# Altium project _PCB_Cubesat_4L_Project_Template.PrjPcb
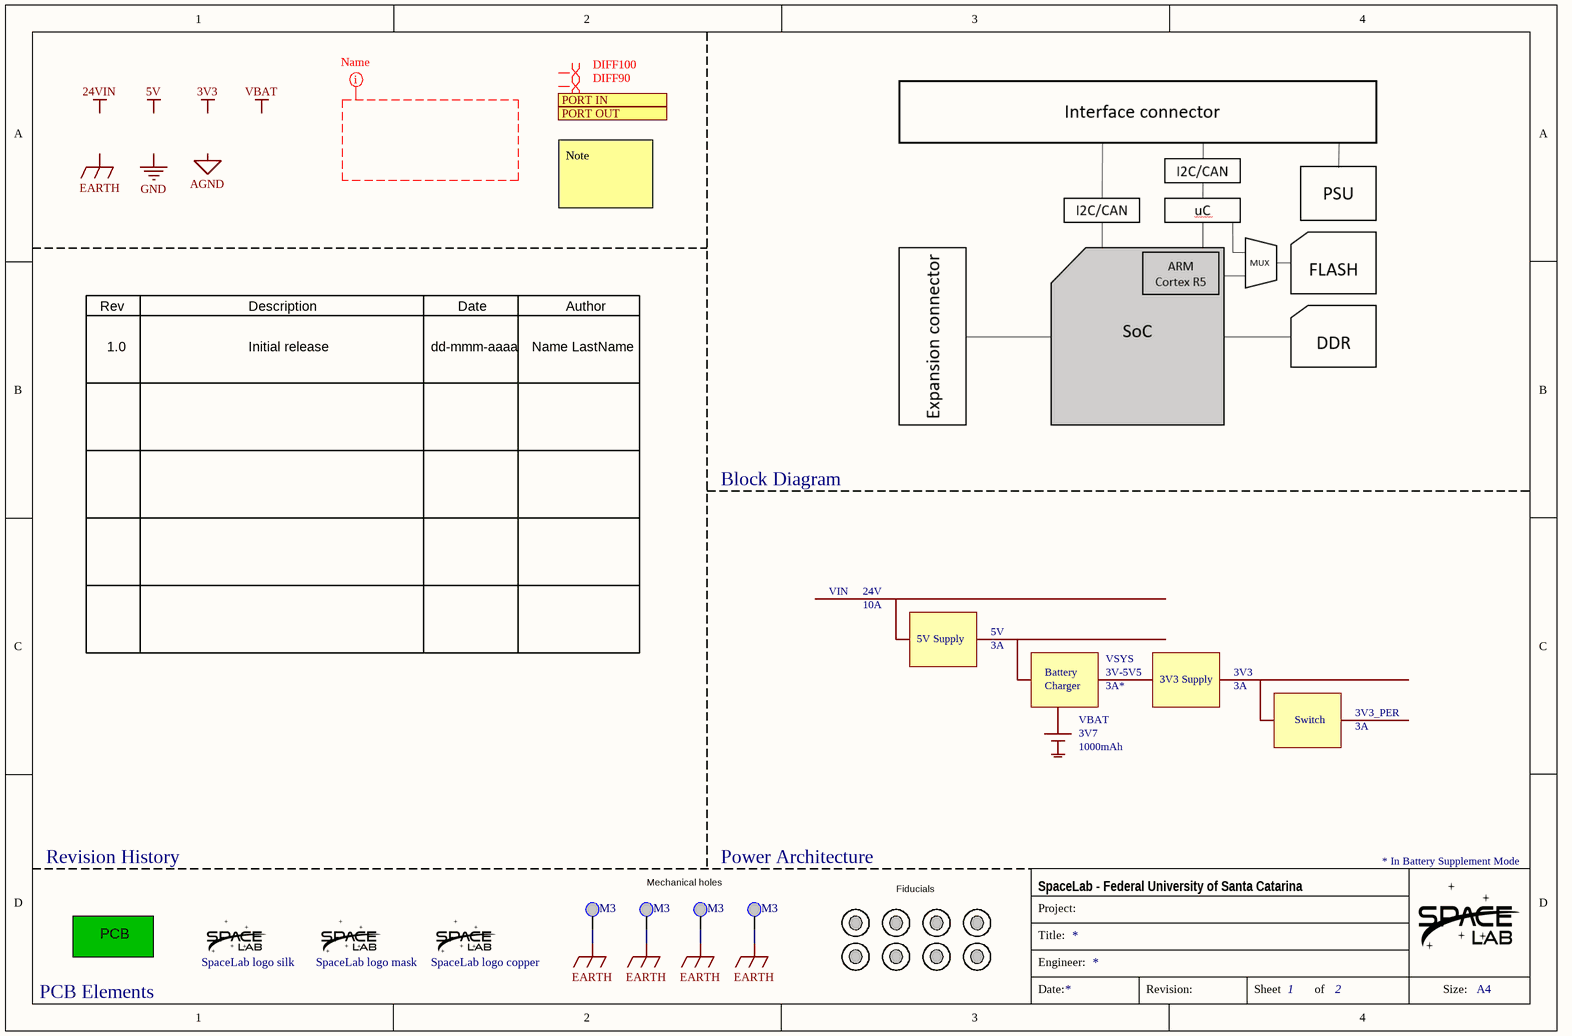
[diagram p0: _PCB_Cubesat_4L - Revision History.SchDoc]
ProjectRevision: 1.0
1 sheet, 16 parts. Net scope: flat (ports and power ports of the same name join across sheets).
Board file: _PCB_Cubesat_4L.PcbDoc

## Sheet _PCB_Cubesat_4L - Revision History.SchDoc
size A4; Organization: UFSC; DocumentNumber: 1; Revision: 1.0; SheetNumber: 1; SheetTotal: 2

### Parts
_PCB1  PCB spec  (value not drawn)  (mechanical)
COP1  SpaceLab logo copper  [SpaceLab logo copper]  (no BOM)
FD1  Fiducial 1.3  [Fiducial 1.3mm]  (value not drawn)  (no BOM)
FD2  Fiducial 1.3  [Fiducial 1.3mm]  (value not drawn)  (no BOM)
FD3  Fiducial 1.3  [Fiducial 1.3mm]  (value not drawn)  (no BOM)
FD4  Fiducial 1.3  [Fiducial 1.3mm]  (value not drawn)  (no BOM)
FD5  Fiducial 1.3  [Fiducial 1.3mm]  (value not drawn)  (no BOM)
FD6  Fiducial 1.3  [Fiducial 1.3mm]  (value not drawn)  (no BOM)
FD7  Fiducial 1.3  [Fiducial 1.3mm]  (value not drawn)  (no BOM)
FD8  Fiducial 1.3  [Fiducial 1.3mm]  (value not drawn)  (no BOM)
MASK1  SpaceLab logo mask  [SpaceLab logo mask]  (no BOM)
MEC1  M3  [M3 hole]  (no BOM)
MEC2  M3  [M3 hole]  (no BOM)
MEC3  M3  [M3 hole]  (no BOM)
MEC4  M3  [M3 hole]  (no BOM)
SILK1  SpaceLab logo silk  [SpaceLab logo silk]  (no BOM)

### Ports
PORT IN (in), PORT OUT (out)

### Nets
EARTH: MEC1.0 MEC2.0 MEC3.0 MEC4.0

### Layout directives
net class NetClass: (no net found under the mark)
differential pair; net class DIFF100: (no net found under the mark)
differential pair; net class DIFF90: (no net found under the mark)

### Notes on the sheet
- Note
- Rev
- Description
- Date
- Author
- 1.0
- Initial release
- dd-mmm-aaaa
- Name LastName
- Block Diagram
- VIN
- 24V
- 10A
- 5V Supply
- 5V
- 3A
- Battery
- Charger
- 3V-5V5
- 3A*
- VSYS
- 3V3 Supply
- 3V3
- 3V3_PER
- VBAT
- 3V7
- 1000mAh
- Switch
- Revision History
- Mechanical holes
- Power Architecture
- Fiducials
- * In Battery Supplement Mode
- (near _PCB1) PCB Elements
- Labels drawn without touching a wire or pin: 3V3, 5V, 24VIN, AGND, EARTH, GND, VBAT
- Project:
- SpaceLab - Federal University of Santa Catarina
- Title:
- Engineer:
- Date:
- Revision:
- Sheet
- of
- Size:
- A4

### Library data of the parts
_PCB1 = PCB
COP1 = SpaceLab logo copper: SpaceLab logo on copper layer
FD1-FD8 = Fiducial 1.3: Fiducial 1.3mm
MASK1 = SpaceLab logo mask: SpaceLab logo on solder mask layer
MEC1-MEC4 = M3 hole
SILK1 = SpaceLab logo silk: SpaceLab logo on silk screen layer